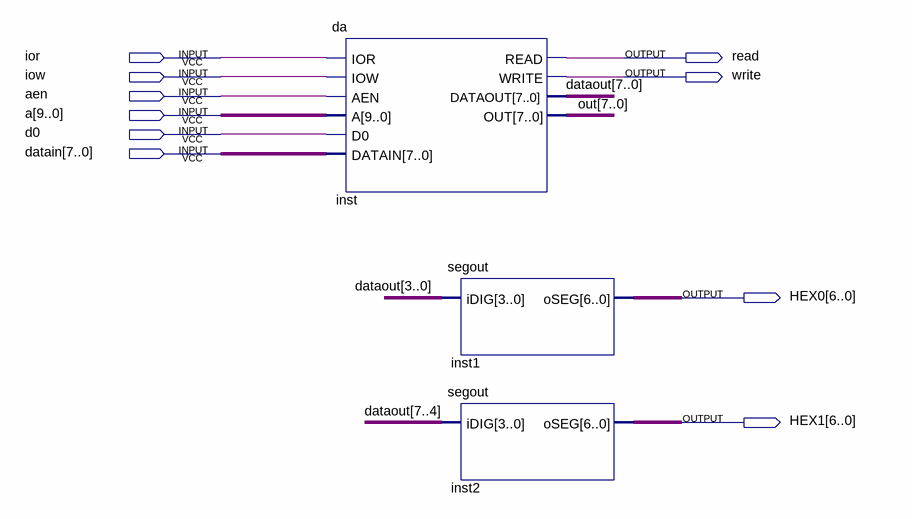
[diagram p0: schematic sheet]
// Quartus schematic DA_down.bdf as structural Verilog: 3 symbols, 10 pins
module DA_down (
  input  ior,
  input  iow,
  input  aen,
  input  [9:0] a,
  input  d0,
  input  [7:0] datain,
  output read,
  output write,
  output [6:0] HEX0,
  output [6:0] HEX1
);

  wire [7:0] dataout, out;

  da inst (
    .IOR(ior), .IOW(iow), .AEN(aen), .A(a), .D0(d0), .DATAIN(datain), .READ(read), .WRITE(write),
    .DATAOUT(dataout), .OUT(out));
  segout inst1 (.iDIG(dataout[3:0]), .oSEG(HEX0));
  segout inst2 (.iDIG(dataout[7:4]), .oSEG(HEX1));
endmodule
